# EAGLE schematic UbalToBal (EAGLE 8.4.1)
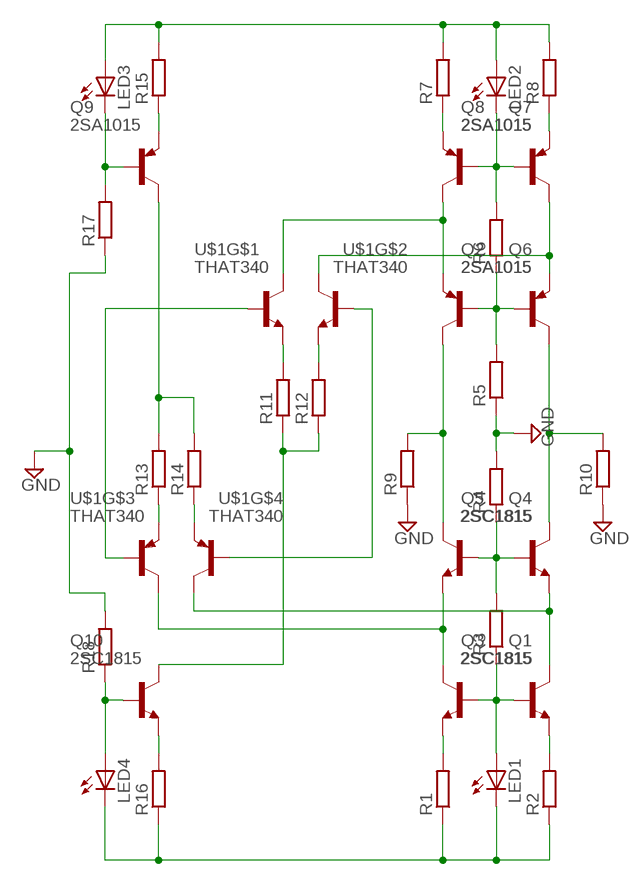
[diagram p0: schematic, sheet 1]

## Parts
LED1  LED5MM  [LED5MM]
LED2  LED5MM  [LED5MM]
LED3  LED5MM  [LED5MM]
LED4  LED5MM  [LED5MM]
Q1  2SC1815  [TO92-BCE]
Q2  2SA1015  [TO92-BCE]
Q3  2SC1815  [TO92-BCE]
Q4  2SC1815  [TO92-BCE]
Q5  2SC1815  [TO92-BCE]
Q6  2SA1015  [TO92-BCE]
Q7  2SA1015  [TO92-BCE]
Q8  2SA1015  [TO92-BCE]
Q9  2SA1015  [TO92-BCE]
Q10  2SC1815  [TO92-BCE]
R1  R-EU_MELF0204W  [MINI_MELF-0204W]
R2  R-EU_MELF0204W  [MINI_MELF-0204W]
R3  R-EU_MELF0204W  [MINI_MELF-0204W]
R4  R-EU_MELF0204W  [MINI_MELF-0204W]
R5  R-EU_MELF0204W  [MINI_MELF-0204W]
R6  R-EU_MELF0204W  [MINI_MELF-0204W]
R7  R-EU_MELF0204W  [MINI_MELF-0204W]
R8  R-EU_MELF0204W  [MINI_MELF-0204W]
R9  R-EU_MELF0204W  [MINI_MELF-0204W]
R10  R-EU_MELF0204W  [MINI_MELF-0204W]
R11  R-EU_MELF0204W  [MINI_MELF-0204W]
R12  R-EU_MELF0204W  [MINI_MELF-0204W]
R13  R-EU_MELF0204W  [MINI_MELF-0204W]
R14  R-EU_MELF0204W  [MINI_MELF-0204W]
R15  R-EU_MELF0204W  [MINI_MELF-0204W]
R16  R-EU_MELF0204W  [MINI_MELF-0204W]
R17  R-EU_MELF0204W  [MINI_MELF-0204W]
R18  R-EU_MELF0204W  [MINI_MELF-0204W]
U$1  THAT340  [DIP254P762X510-14]

## Nets
GND: R4.2 R5.1 R9.1 R10.1 R17.1 R18.2
N$1: LED1.K(C) LED4.K(C) R1.1 R2.1 R16.1
N$2: Q1.E R1.2
N$3: Q3.E R2.2
N$4: Q3.C Q5.E U$1.8(C)
N$5: Q1.C Q4.E U$1.7(C)
N$6: LED1.A Q1.B Q3.B R3.1
N$7: Q4.B Q5.B R3.2 R4.1
N$8: LED3.K(C) Q9.B R17.2
N$9: Q4.C Q6.C R9.2
N$10: Q2.C Q5.C R10.2
N$11: Q2.B Q6.B R5.2 R6.1
N$12: Q6.E Q7.C U$1.1(C)
N$13: LED2.K(C) Q7.B Q8.B R6.2
N$14: Q2.E Q8.C U$1.14(C)
N$15: Q7.E R7.1
N$16: Q8.E R8.1
N$17: LED2.A LED3.A R7.2 R8.2 R15.2
N$18: Q9.E R15.1
N$19: Q9.C R13.2 R14.2
N$21: R14.1 U$1.10(E)
N$22: R13.1 U$1.5(E)
N$23: U$1.9(B) U$1.13(B)
N$24: U$1.2(B) U$1.6(B)
N$25: R11.2 U$1.3(E)
N$26: R12.2 U$1.12(E)
N$27: Q10.C R11.1 R12.1
N$28: Q10.E R16.2
N$29: LED4.A Q10.B R18.1

## Library data of the parts
LED1-LED3 = led:LED: LED OSRAM: - CHIPLED LG R971, LG N971, LY N971, LG Q971, LY Q971, LO R971, LY R971 LH N974, LH R974 LS Q976, LO Q976, LY Q976 LO Q996 - Hyper CHIPLED LW Q18S LB Q993, LB Q99A, LB R99A - SideLED LS A670, LO A670, LY A670, LG A670, LP A670 LB A673, LV A673, LT A673, LW A673 LH A674 LY A675 LS A676, LA A676, LO A676, LY A676, LW A676 LS A679, LY A679, LG A679 - Hyper Micro SIDELED® LS Y876, LA Y876, LO Y876, LY Y876 LT Y87S - SmartLED LW L88C, LW L88S LB L89C, LB L89S, LG L890 LS L89K, LO L89K, LY L89K LS L896, LA L896, LO L896, LY L896 - TOPLED LS T670, LO T670, LY T670, LG T670, LP T670 LSG T670, LSP T670, LSY T670, LOP T670, LYG T670 LG T671, LOG T671, LSG T671 LB T673, LV T673, LT T673, LW T673 LH T674 LS T676, LA T676, LO T676, LY T676, LB T676, LH T676, LSB T676, LW T676 LB T67C, LV T67C, LT T67C, LS T67K, LO T67K, LY T67K, LW E67C LS E67B, LA E67B, LO E67B, LY E67B, LB E67C, LV E67C, LT E67C LW T67C LS T679, LY T679, LG T679 LS T770, LO T770, LY T770, LG T770, LP T770 LB T773, LV T773, LT T773, LW T773 LH T774 LS E675, LA E675, LY E675, LS T675 LS T776, LA T776, LO T776, LY T776, LB T776 LHGB T686 LT T68C, LB T68C - Hyper Mini TOPLED® LB M676 - Mini TOPLED Santana® LG M470 LS M47K, LO M47K, LY M47K Source: http://www.osram.convergy.de LUXEON: - LUMILED® LXK2-PW12-R00, LXK2-PW12-S00, LXK2-PW14-U00, LXK2-PW14-V00 LXK2-PM12-R00, LXK2-PM12-S00, LXK2-PM14-U00 LXK2-PE12-Q00, LXK2-PE12-R00, LXK2-PE12-S00, LXK2-PE14-T00, LXK2-PE14-U00 LXK2-PB12-K00, LXK2-PB12-L00, LXK2-PB12-M00, LXK2-PB14-N00, LXK2-PB14-P00, LXK2-PB14-Q00 LXK2-PR12-L00, LXK2-PR12-M00, LXK2-PR14-Q00, LXK2-PR14-R00 LXK2-PD12-Q00, LXK2-PD12-R00, LXK2-PD12-S00 LXK2-PH12-R00, LXK2-PH12-S00 LXK2-PL12-P00, LXK2-PL12-Q00, LXK2-PL12-R00 Source: www.luxeon.com KINGBRIGHT: KA-3528ASYC Source: www.kingbright.com
LED4 = led:LED: LED OSRAM: - CHIPLED LG R971, LG N971, LY N971, LG Q971, LY Q971, LO R971, LY R971 LH N974, LH R974 LS Q976, LO Q976, LY Q976 LO Q996 - Hyper CHIPLED LW Q18S LB Q993, LB Q99A, LB R99A - SideLED LS A670, LO A670, LY A670, LG A670, LP A670 LB A673, LV A673, LT A673, LW A673 LH A674 LY A675 LS A676, LA A676, LO A676, LY A676, LW A676 LS A679, LY A679, LG A679 - Hyper Micro SIDELED® LS Y876, LA Y876, LO Y876, LY Y876 LT Y87S - SmartLED LW L88C, LW L88S LB L89C, LB L89S, LG L890 LS L89K, LO L89K, LY L89K LS L896, LA L896, LO L896, LY L896 - TOPLED LS T670, LO T670, LY T670, LG T670, LP T670 LSG T670, LSP T670, LSY T670, LOP T670, LYG T670 LG T671, LOG T671, LSG T671 LB T673, LV T673, LT T673, LW T673 LH T674 LS T676, LA T676, LO T676, LY T676, LB T676, LH T676, LSB T676, LW T676 LB T67C, LV T67C, LT T67C, LS T67K, LO T67K, LY T67K, LW E67C LS E67B, LA E67B, LO E67B, LY E67B, LB E67C, LV E67C, LT E67C LW T67C LS T679, LY T679, LG T679 LS T770, LO T770, LY T770, LG T770, LP T770 LB T773, LV T773, LT T773, LW T773 LH T774 LS E675, LA E675, LY E675, LS T675 LS T776, LA T776, LO T776, LY T776, LB T776 LHGB T686 LT T68C, LB T68C - Hyper Mini TOPLED® LB M676 - Mini TOPLED Santana® LG M470 LS M47K, LO M47K, LY M47K Source: http://www.osram.convergy.de LUXEON: - LUMILED® LXK2-PW12-R00, LXK2-PW12-S00, LXK2-PW14-U00, LXK2-PW14-V00 LXK2-PM12-R00, LXK2-PM12-S00, LXK2-PM14-U00 LXK2-PE12-Q00, LXK2-PE12-R00, LXK2-PE12-S00, LXK2-PE14-T00, LXK2-PE14-U00 LXK2-PB12-K00, LXK2-PB12-L00, LXK2-PB12-M00, LXK2-PB14-N00, LXK2-PB14-P00, LXK2-PB14-Q00 LXK2-PR12-L00, LXK2-PR12-M00, LXK2-PR14-Q00, LXK2-PR14-R00 LXK2-PD12-Q00, LXK2-PD12-R00, LXK2-PD12-S00 LXK2-PH12-R00, LXK2-PH12-S00 LXK2-PL12-P00, LXK2-PL12-Q00, LXK2-PL12-R00 Source: www.luxeon.com KINGBRIGHT: KA-3528ASYC Source: www.kingbright.com; SPICEPREFIX: D
Q1 Q3-Q5 = tranzistory NPN:2SC1815: NPN Transistor
Q2 Q6-Q9 = tranzistory PNP:2SA1015: PNP Transistor
Q10 = tranzistory NPN:2SC1815: NPN Transistor; SPICEPREFIX: Q
R1-R15 R17 R18 = Vwvwbg:R-EU_: RESISTOR, European symbol
R16 = Vwvwbg:R-EU_: RESISTOR, European symbol; SPICEPREFIX: R
U$1 = transistor-arrays:THAT340